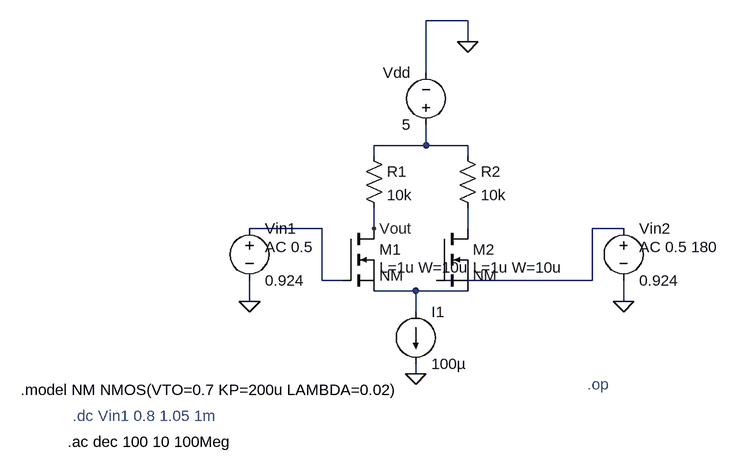
[diagram p0: schematic Resistive_differential_amplifier.asc]
Resistive_differential_amplifier.asc, the LTspice schematic file:
Version 4.1
SHEET 1 880 680
WIRE 272 -688 208 -688
WIRE 272 -656 272 -688
WIRE 208 -608 208 -688
WIRE 208 -496 208 -528
WIRE 208 -496 128 -496
WIRE 272 -496 208 -496
WIRE 128 -480 128 -496
WIRE 272 -480 272 -496
WIRE 48 -368 -64 -368
WIRE 128 -368 128 -400
WIRE 272 -368 272 -400
WIRE 512 -368 464 -368
WIRE 48 -288 48 -368
WIRE 80 -288 48 -288
WIRE 464 -288 464 -368
WIRE 464 -288 224 -288
WIRE 192 -272 128 -272
WIRE 272 -272 192 -272
WIRE -64 -256 -64 -288
WIRE 512 -256 512 -288
WIRE 192 -240 192 -272
WIRE 192 -144 192 -160
FLAG 192 -144 0
FLAG 272 -656 0
FLAG 512 -256 0
FLAG -64 -256 0
FLAG 128 -368 Vout
SYMBOL res 112 -496 R0
SYMATTR InstName R1
SYMATTR Value 10k
SYMBOL res 256 -496 R0
SYMATTR InstName R2
SYMATTR Value 10k
SYMBOL nmos 80 -368 R0
WINDOW 39 56 60 Left 2
SYMATTR InstName M1
SYMATTR Value NM
SYMATTR SpiceLine L=1u W=10u
SYMBOL nmos 224 -368 R0
WINDOW 39 56 60 Left 2
SYMATTR InstName M2
SYMATTR Value NM
SYMATTR SpiceLine L=1u W=10u
SYMBOL current 192 -240 R0
WINDOW 123 0 0 Left 0
WINDOW 39 0 0 Left 0
SYMATTR InstName I1
SYMATTR Value 100µ
SYMBOL voltage -64 -384 R0
WINDOW 123 24 44 Left 2
WINDOW 39 0 0 Left 0
SYMATTR InstName Vin1
SYMATTR Value 0.924
SYMATTR Value2 AC 0.5
SYMBOL voltage 512 -384 R0
WINDOW 123 24 44 Left 2
WINDOW 39 0 0 Left 0
SYMATTR InstName Vin2
SYMATTR Value 0.924
SYMATTR Value2 AC 0.5 180
SYMBOL voltage 208 -512 R180
WINDOW 0 24 96 Left 2
WINDOW 3 24 16 Left 2
WINDOW 123 0 0 Left 0
WINDOW 39 0 0 Left 0
SYMATTR InstName Vdd
SYMATTR Value 5
TEXT -416 -120 Left 2 !.model NM NMOS(VTO=0.7 KP=200u LAMBDA=0.02)
TEXT 456 -128 Left 2 ;.op
TEXT -336 -80 Left 2 ;.dc Vin1 0.8 1.05 1m
TEXT -344 -40 Left 2 !.ac dec 100 10 100Meg

The netlist it stands for:
* Resistive_differential_amplifier.asc
R1 N001 Vout 10k
R2 N001 N003 10k
M1 Vout N002 N005 N005 NM L=1u W=10u
M2 N003 N004 N005 N005 NM L=1u W=10u
I1 N005 0 100µ
Vin1 N002 0 0.924 AC 0.5
Vin2 N004 0 0.924 AC 0.5 180
Vdd N001 0 5
.model NMOS NMOS
.model PMOS PMOS
.lib standard.mos
.model NM NMOS(VTO=0.7 KP=200u LAMBDA=0.02)
* .op
* .dc Vin1 0.8 1.05 1m
.ac dec 100 10 100Meg
.backanno
.end